# Altium schematic sheet FOLLOWER_DIVIDER.SchDoc: AI ARTIQ Driver
size 420 x 297 mm; Author: G.Kasprowicz; CompanyName: CTI; Organization: CTI; Address1: CTI; Address2: Nowowiejska 15/19 00-665 Warsaw; Address3: gkasprow@gmail.com; DocumentNumber: 11; Revision: 1.0; SheetNumber: 11; SheetTotal: 11; ModifiedBy: -; CheckedDate: -; Title2: FOLLOWER DIVIDER; DivGrp: CTI; ModifiedDate: -; ProjectName: Sensor Box
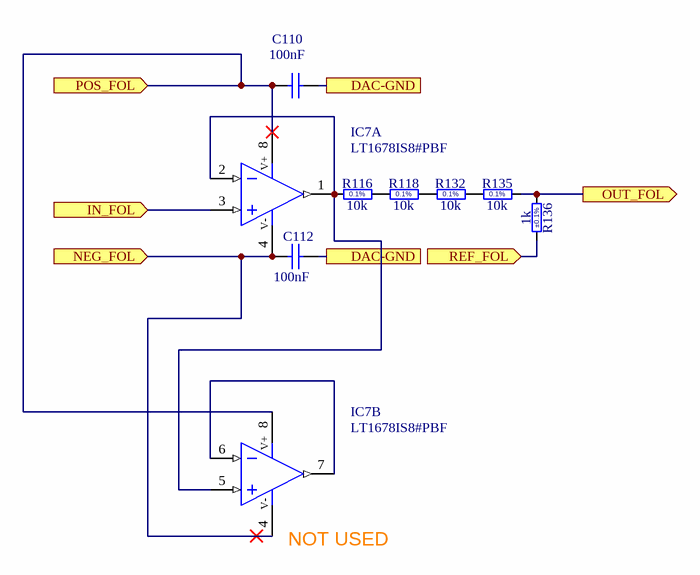
[diagram p0: FOLLOWER_DIVIDER.SchDoc]

## Parts
C110  100nF  [CAPC1608X87N]
C112  100nF  [CAPC1608X87N]
IC7  LT1678IS8#PBF  [SOIC127P600X175-8N]  (parts A,B of 2)
R116  10k  [RESC1608X55N]
R118  10k  [RESC1608X55N]
R132  10k  [RESC1608X55N]
R135  10k  [RESC1608X55N]
R136  1k  Tolerance: ±0.1%  [RESC1608X64N]

## Ports
DAC-GND, IN_FOL (in), NEG_FOL (in), OUT_FOL (out), POS_FOL (in), REF_FOL (in)

## Nets
DAC-GND: C110.2 C112.2 ; port DAC-GND
IN_FOL: IC7.3(IN+) ; port IN_FOL
NEG_FOL: C112.1 IC7.4(V-) ; port NEG_FOL
OUT_FOL: R135.2 R136.1 ; port OUT_FOL
POS_FOL: C110.1 IC7.8(V+) ; port POS_FOL
REF_FOL: R136.2 ; port REF_FOL
NetIC7_1: IC7.1(OUT) IC7.2(IN-) IC7.5(IN+) R116.1
NetIC7_6: IC7.6(IN-) IC7.7(OUT)
NetR116_2: R116.2 R118.1
NetR118_2: R118.2 R132.1
NetR132_2: R132.2 R135.1

## Notes on the sheet
- (near IC7) NOT USED
- Project/Equipment
- Document
- Designer
- Drawn by
- Check.by
- Copyright 2018.
  This documentation describes Open Hardware and is licensed under the CERN OHL v.1.1. You may redistribute and modify this documentation under the terms of the CERN OHL v.1.1. (http://ohwr.org/CERNOHL). This documentation is distributed WITHOUT ANY EXPRESS OR IMPLIED WARRANTY, INCLUDING OF MERCHANTABILITY, SATISFACTORY QUALITY AND FITNESS FOR A PARTICULAR PURPOSE. Please see the CERN OHL v.1.1 for applicable conditions.
- Contact
- File
- Last Mod.
- Print Date
- Sheet
- Size
- A3
- of
- Rev
- (in symbol R0603_10K_0.1%_0.063W_10PPM) 0.1%

## Library data of the parts
C110 C112 = CC0603_100NF_50V_10%_X7R: Non-polarised capacitor; Part Description: SMD Multilayer Chip Ceramic Capacitor; Manufacturer: GENERIC; Manufacturer1 Part Number: 223858615649; Voltage: 50V; TC: X7R; Tolerance: ±10%; Part Number: CC0603_100NF_50V_10%_X7R; Component Kind: Standard; Component Type: Standard; Pin Count: 2; Value: 100nF; Status: Preferred; Manufacturer Part Number: CC0603_100NF_50V_10%_X7R; Case: 0603; Mounted: Yes; Socket: No; SMD: Yes; Sense: No; Manufacturer1 Example: PHYCOMP; Manufacturer1 ComponentHeight: 0.87mm; HelpURL: \\cern.ch\dfs\Applications\Altium\Datasheets\CC0603_X7R_PHYCOMP.pdf; Author: CERN DEM JLC; CreateDate: 03.12.2007; LatestRevisionDate: 03.12.2007
IC7 = LT1678IS8#PBF: Dual Operational Amplifier; Part Description: Dual Low Noise, Rail-to-Rail, Precision Operational Amplifier; Manufacturer: LINEAR TECHNOLOGY; PressFit: No; Bonding: No; Part Number: LT1678IS8#PBF; Component Kind: Standard; Component Type: Standard; Device: LT1678IS8#PBF; PackageDescription: SOIC 8, Pitch 1.27mm - Body 4x5mm, IPC Medium Density; Manufacturer Part Number: LT1678IS8#PBF; Pin Count: 8; Case: SOIC8; Mounted: Yes; Socket: No; SMD: Yes; Sense: No; ComponentHeight: 1.75mm; Author: CERN DEM JLC; HelpURL: \\cern.ch\dfs\Applications\Altium\Datasheets\LT1678IS8#PBF.pdf; CreateDate: 09.07.2014; LatestRevisionDate: 09.07.2014
R116 R118 R132 R135 = R0603_10K_0.1%_0.063W_10PPM: Resistor - 0.1%; Part Description: Thin Film Chip Resistor; Manufacturer: GENERIC; Manufacturer1 Part Number: RN73C1J10KBTDF; Power: 0.063W; TC: ±10ppm; PressFit: No; Part Number: R0603_10K_0.1%_0.063W_10PPM; Component Kind: Standard; Component Type: Standard; Pin Count: 2; Value: 10k; Status: Not Recommended; Tolerance: ±0.1%; Manufacturer Part Number: R0603_10K_0.1%_0.063W_10PPM; Case: 0603; Mounted: Yes; Sense: No; Socket: No; SMD: Yes; Manufacturer1 Example: TYCO HOLSWORTHY; Manufacturer1 ComponentHeight: 0.5mm; HelpURL: \\cern.ch\dfs\Applications\Altium\Datasheets\R0603_Tyco_RN73.pdf; Author: CERN DEM JLC; CreateDate: 03.12.2007; LatestRevisionDate: 13.03.2008
R136 = R0603_1K_0.1%_0.1W_25PPM: Resistor - 0.1%; Part Description: Thin Film Chip Resistor; Manufacturer: GENERIC; Manufacturer1 Part Number: ERA3AEB102V; Power: 0.1W; TC: ±25ppm/°C; PressFit: No; Part Number: R0603_1K_0.1%_0.1W_25PPM; Component Kind: Standard; Component Type: Standard; Pin Count: 2; Value: 1k; Status: Not Recommended; Manufacturer Part Number: R0603_1K_0.1%_0.1W_25PPM; Case: 0603; Mounted: Yes; Sense: No; Socket: No; SMD: Yes; Manufacturer1 Example: PANASONIC; Manufacturer1 ComponentHeight: 0.55mm; HelpURL: \\cern.ch\dfs\Applications\Altium\Datasheets\R0603_PANASONIC_ERA.pdf; Author: CERN DEM JLC; CreateDate: 11.01.2017; LatestRevisionDate: 11.01.2017